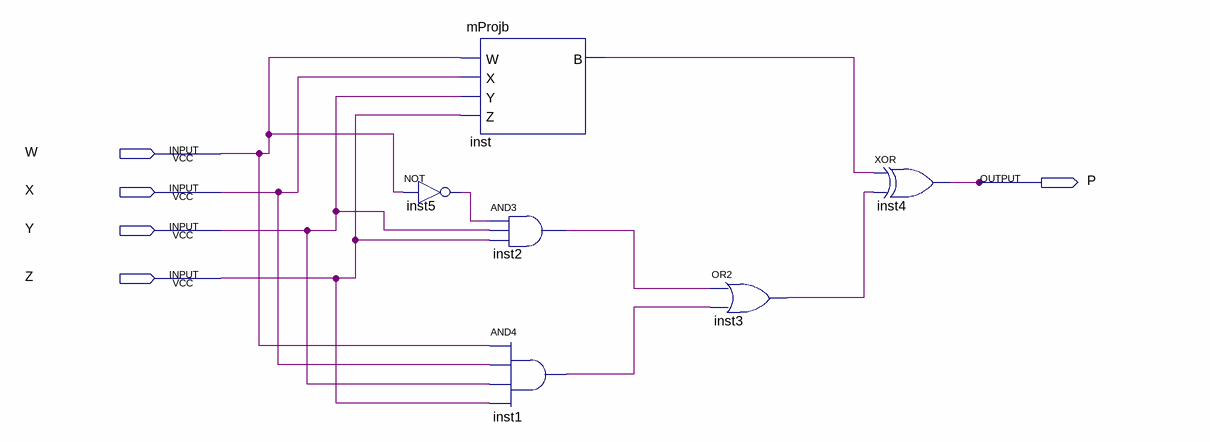
[diagram p0: schematic sheet]
// Quartus schematic mProjFIX.bdf as structural Verilog: 6 symbols, 5 pins
module mProjFIX (
  input  W,
  input  X,
  input  Y,
  input  Z,
  output P
);

  wire inst1_out, inst2_out, inst3_out, inst5_out, inst_b;

  not inst5 (inst5_out, W);
  mProjb inst (.W(W), .X(X), .Y(Y), .Z(Z), .B(inst_b));
  and inst2 (inst2_out, inst5_out, Y, Z);
  and inst1 (inst1_out, W, X, Y, Z);
  or inst3 (inst3_out, inst2_out, inst1_out);
  xor inst4 (P, inst_b, inst3_out);
endmodule
